# Altium schematic sheet Power.SchDoc
size A4; SheetNumber: 1; SheetTotal: 3
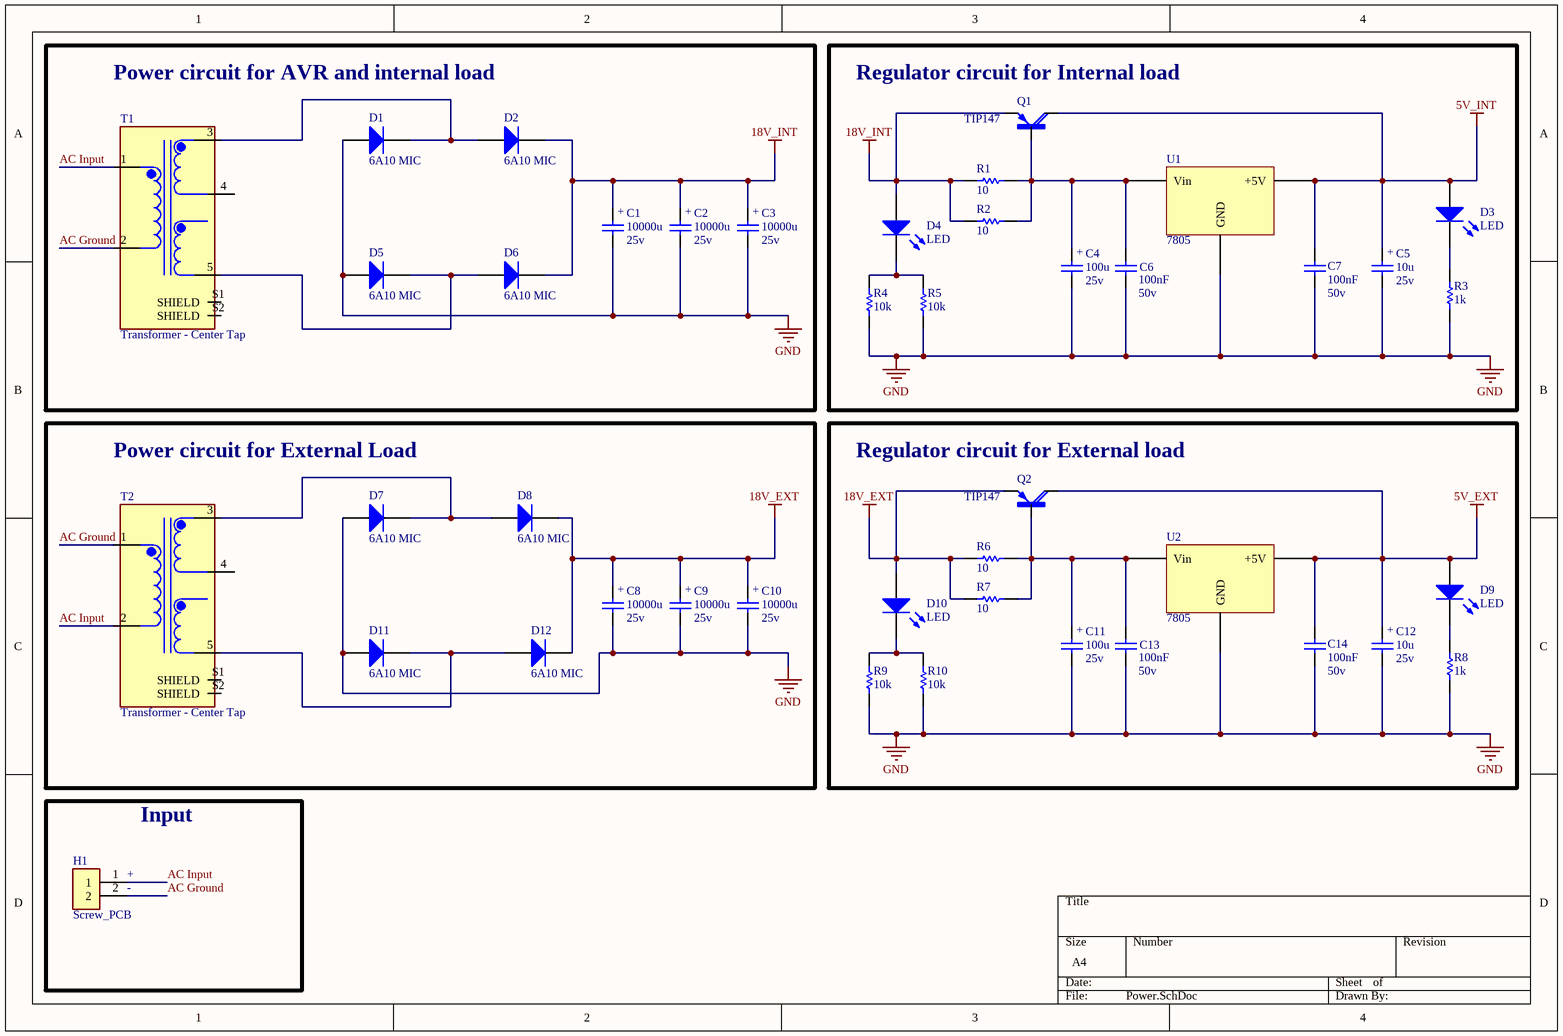
[diagram p0: Power.SchDoc]

## Parts
C1  Volte: 25v  [MY_E7.5-16mm]  (hidden comment: 10000u)
C2  Volte: 25v  [MY_E7.5-16mm]  (hidden comment: 10000u)
C3  Volte: 25v  [MY_E7.5-16mm]  (hidden comment: 10000u)
C4  Volte: 25v  [MY_E2.5-5mm]  (hidden comment: 100u)
C5  Volte: 25v  [MY_E2.5-5mm]  (hidden comment: 10u)
C6  Volte: 50v  [C0805]  (hidden comment: 100nF)
C7  Volte: 50v  [C0805]  (hidden comment: 100nF)
C8  Volte: 25v  [MY_E7.5-16mm]  (hidden comment: 10000u)
C9  Volte: 25v  [MY_E7.5-16mm]  (hidden comment: 10000u)
C10  Volte: 25v  [MY_E7.5-16mm]  (hidden comment: 10000u)
C11  Volte: 25v  [MY_E2.5-5mm]  (hidden comment: 100u)
C12  Volte: 25v  [MY_E2.5-5mm]  (hidden comment: 10u)
C13  Volte: 50v  [C0805]  (hidden comment: 100nF)
C14  Volte: 50v  [C0805]  (hidden comment: 100nF)
D1  6A10 MIC  [R6_Axial]
D2  6A10 MIC  [R6_Axial]
D3  LED  [My_LED3MM]
D4  LED  [My_LED3MM]
D5  6A10 MIC  [R6_Axial]
D6  6A10 MIC  [R6_Axial]
D7  6A10 MIC  [R6_Axial]
D8  6A10 MIC  [R6_Axial]
D9  LED  [My_LED3MM]
D10  LED  [My_LED3MM]
D11  6A10 MIC  [R6_Axial]
D12  6A10 MIC  [R6_Axial]
H1  Screw_PCB  [Barrier_TB_8.26mm]
Q1  TIP147  [SOT93]
Q2  TIP147  [SOT93]
R1  10  [MY_(2w)_0617_22]
R2  10  [MY_(2w)_0617_22]
R3  1k  [R0603]
R4  10k  [R0603]
R5  10k  [R0603]
R6  10  [MY_(2w)_0617_22]
R7  10  [MY_(2w)_0617_22]
R8  1k  [R0603]
R9  10k  [R0603]
R10  10k  [R0603]
T1  Transformer - Center Tap  [Transformer_CT]
T2  Transformer - Center Tap  [Transformer_CT]
U1  7805  [MY_TO220_Heatsink 2 TO-220 (20x14x9mm)]
U2  7805  [MY_TO220_Heatsink 2 TO-220 (20x14x9mm)]

## Blocks framed on the sheet
Power circuit for AVR and internal load: C1-C3 D1 D2 D5 D6 T1
Regulator circuit for Internal load: C4-C7 D3 D4 Q1 R1-R5 U1
Power circuit for External Load: C8-C10 D7 D8 D11 D12 T2
Regulator circuit for External load: C11-C14 D9 D10 Q2 R6-R10 U2
Input: H1

## Nets
5V_EXT: C12.+ C14.2 D9.A Q2.C U2.3(+5V)
5V_INT: C5.+ C7.2 D3.A Q1.C U1.3(+5V)
18V_EXT: C8.+ C9.+ C10.+ D8.K D10.A D12.K Q2.E R6.1 R7.1
18V_INT: C1.+ C2.+ C3.+ D2.K D4.A D6.K Q1.E R1.1 R2.1
GND: C1.- C2.- C3.- C4.- C5.- C6.1 C7.1 C8.- C9.- C10.- C11.- C12.- C13.1 C14.1 D1.A D5.A D7.A D11.A R3.2 R4.2 R5.2 R8.2 R9.2 R10.2 U1.2(GND) U2.2(GND)
AC Ground: H1.2 T1.2 T2.1
AC Input: H1.1 T1.1 T2.2
NetC4_+: C4.+ C6.2 Q1.B R1.2 R2.2 U1.1(Vin)
NetC11_+: C11.+ C13.2 Q2.B R6.2 R7.2 U2.1(Vin)
NetD1_K: D1.K D2.A T1.3
NetD3_K: D3.K R3.1
NetD4_K: D4.K R4.1 R5.1
NetD5_K: D5.K D6.A T1.5
NetD7_K: D7.K D8.A T2.3
NetD9_K: D9.K R8.1
NetD10_K: D10.K R9.1 R10.1
NetD11_K: D11.K D12.A T2.5

Not connected (* = marked no-connect by the designer): T1 4 S1(SHIELD) S2(SHIELD); T2 4 S1(SHIELD) S2(SHIELD)

## Notes on the sheet
- (in symbol Screw_PCB) +; -

## Library data of the parts
C1-C5 C8-C12 = Cap Pol: Polar capacitor; ASiD Part Number: C-AS
  C1-C3 C8-C10: Value: 10000u
  C4 C11: Value: 100u
  C5 C12: Value: 10u
C6 C7 C13 C14 = Cap ceramic: None polar capacitor; ASiD Part Number: C-AS; Value: 100nF
D1 D2 D5-D8 D11 D12 = 1N4007: 1 Amp Diode; ASiD Part Number: 1n4007-AS
D3 D4 D9 D10 = LED: Typical INFRARED GaAs LED; ASiD Part Number: LED-AS
H1 = Screw_PCB: PCB to screw header; MF: TE Connectivity; MP: 282837-2; SnapEDA_Link: https://www.snapeda.com/parts/282837-2/TE+Connectivity+AMP+Connectors/view-part/?ref=snap; Price: None; Check_prices: https://www.snapeda.com/parts/282837-2/TE+Connectivity+AMP+Connectors/view-part/?ref=eda; Purchase-URL: https://pricing.snapeda.com/search/part/282837-2/?ref=eda; Value: *; Availability: In Stock; Package: None
Q1 Q2 = TIP147: Bipolar (BJT) Transistor PNP 100 V 10 A - 125 W Through Hole TO-218; MF: NTE Electronics, Inc; SnapEDA_Link: https://www.snapeda.com/parts/TIP147/NTE+Electronics/view-part/?ref=snap; Package: None; Value: *; MP: TIP147; Check_prices: https://www.snapeda.com/parts/TIP147/NTE+Electronics/view-part/?ref=eda
R1-R10 = Res: Standard resistor; ASiD Part Number: Res-AS
  R1 R2 R6 R7: Value: 10
  R3 R8: Value: 1k
  R4 R5 R9 R10: Value: 10k
T1 T2 = Transformer - Center Tap: Voltage - Primary 220V,Voltage - Secondary Parallel; MP: F-151XP; Package: None; Price: None; Value: *; Availability: Unavailable
U1 U2 = 7805: Regulator; ASiD Part Number: 7805-AS